# Altium schematic sheet motor.SchDoc
size A4
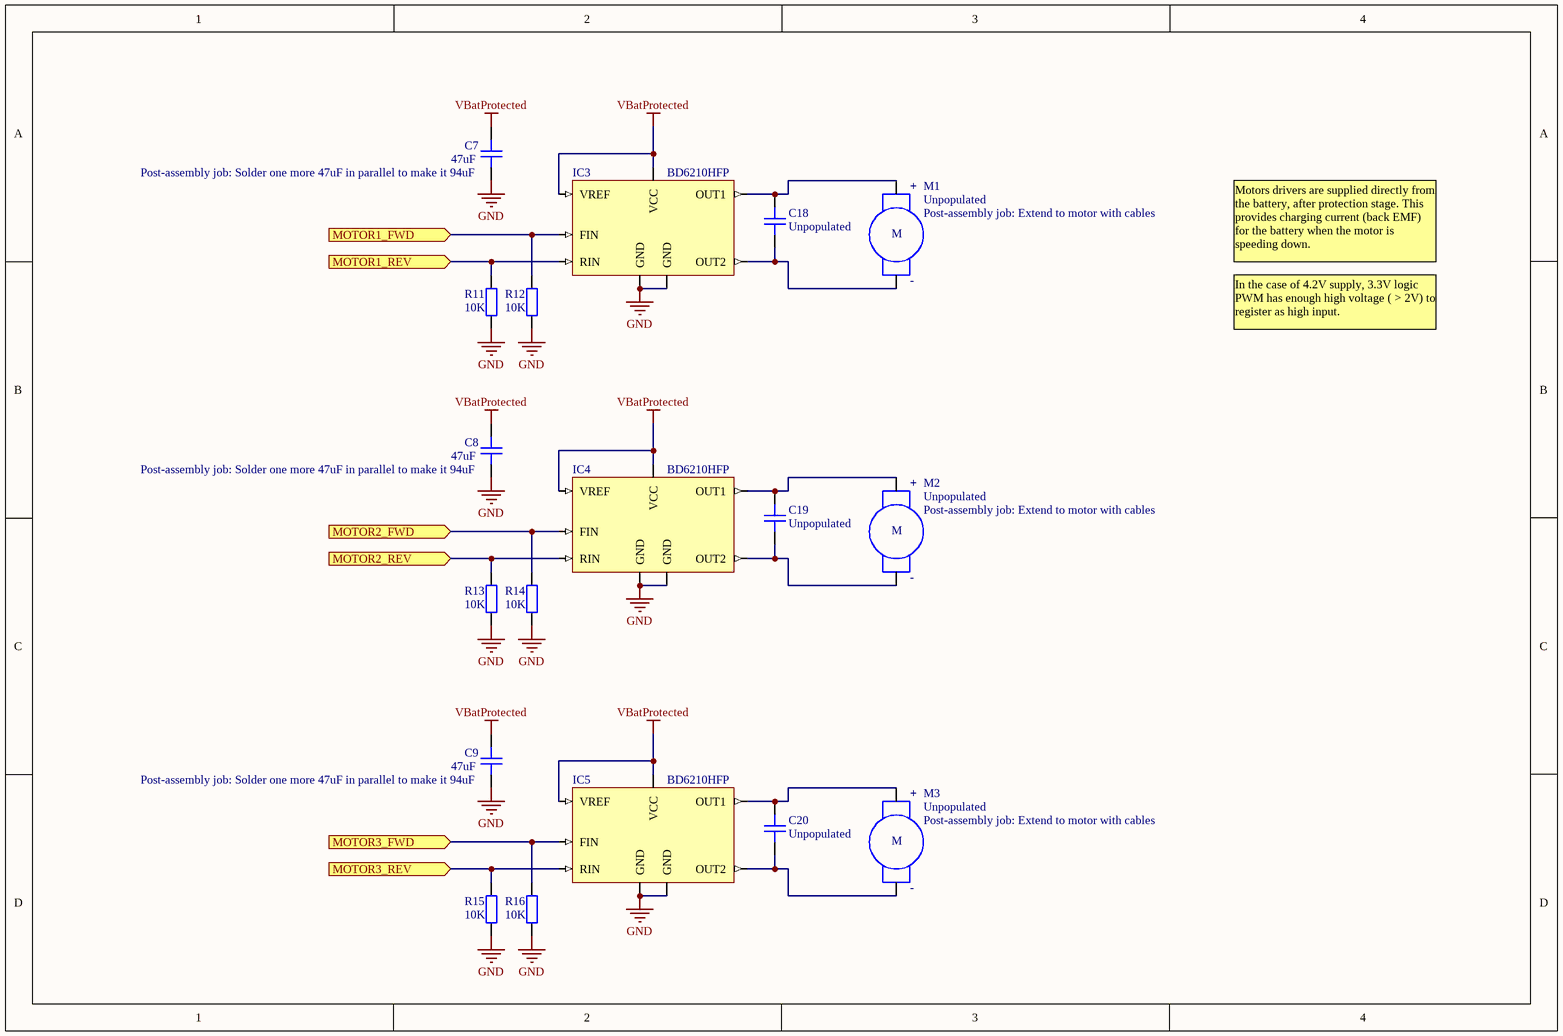
[diagram p0: motor.SchDoc]

## Parts
C7  47uF  Post-assembly job: Solder one more 47uF in parallel to make it 94uF  [2012[0805]_M]
C8  47uF  Post-assembly job: Solder one more 47uF in parallel to make it 94uF  [2012[0805]_M]
C9  47uF  Post-assembly job: Solder one more 47uF in parallel to make it 94uF  [2012[0805]_M]
C18  Unpopulated  [2012[0805]_M]
C19  Unpopulated  [2012[0805]_M]
C20  Unpopulated  [2012[0805]_M]
IC3  BD6210HFP  [HRP7_N]
IC4  BD6210HFP  [HRP7_N]
IC5  BD6210HFP  [HRP7_N]
M1  Unpopulated  Post-assembly job: Extend to motor with cables  [CABLE-TERMINAL1x2]
M2  Unpopulated  Post-assembly job: Extend to motor with cables  [CABLE-TERMINAL1x2]
M3  Unpopulated  Post-assembly job: Extend to motor with cables  [CABLE-TERMINAL1x2]
R11  10K  [1608[0603]_M]
R12  10K  [1608[0603]_M]
R13  10K  [1608[0603]_M]
R14  10K  [1608[0603]_M]
R15  10K  [1608[0603]_M]
R16  10K  [1608[0603]_M]

## Ports
MOTOR1_FWD (in), MOTOR1_REV (in), MOTOR2_FWD (in), MOTOR2_REV (in), MOTOR3_FWD (in), MOTOR3_REV (in)

## Nets
GND: C7.1 C8.1 C9.1 IC3.4(GND) IC3.Heatsink(GND) IC4.4(GND) IC4.Heatsink(GND) IC5.4(GND) IC5.Heatsink(GND) R11.1 R12.1 R13.1 R14.1 R15.1 R16.1
VBatProtected: C7.2 C8.2 C9.2 IC3.1(VREF) IC3.7(VCC) IC4.1(VREF) IC4.7(VCC) IC5.1(VREF) IC5.7(VCC)
MOTOR1_FWD: IC3.3(FIN) R12.2 ; port MOTOR1_FWD
MOTOR1_REV: IC3.5(RIN) R11.2 ; port MOTOR1_REV
MOTOR2_FWD: IC4.3(FIN) R14.2 ; port MOTOR2_FWD
MOTOR2_REV: IC4.5(RIN) R13.2 ; port MOTOR2_REV
MOTOR3_FWD: IC5.3(FIN) R16.2 ; port MOTOR3_FWD
MOTOR3_REV: IC5.5(RIN) R15.2 ; port MOTOR3_REV
NetC18_1: C18.1 IC3.6(OUT2) M1.-
NetC18_2: C18.2 IC3.2(OUT1) M1.+
NetC19_1: C19.1 IC4.6(OUT2) M2.-
NetC19_2: C19.2 IC4.2(OUT1) M2.+
NetC20_1: C20.1 IC5.6(OUT2) M3.-
NetC20_2: C20.2 IC5.2(OUT1) M3.+

## Notes on the sheet
- Motors drivers are supplied directly from the battery, after protection stage. This provides charging current (back EMF) for the battery when the motor is speeding down.
- In the case of 4.2V supply, 3.3V logic PWM has enough high voltage ( > 2V) to register as high input.
- (in symbol DCMotor) M

## Library data of the parts
C7-C9 C18-C20 = Capacitor: Generic Capacitor
  C7-C9: Value: 47uF
  C18-C20: Value: Unpopulated
IC3-IC5 = BD621xHFP: DC Motor driver, full H-bridge
M1-M3 = DCMotor: Generic DC motor; pin to pad: +>1 ->2
R11-R16 = Resistor: Generic Resistor; Value: 10K